# Altium schematic sheet ESD_EARTH.SchDoc
size A3; SheetNumber: 9; SheetTotal: 22
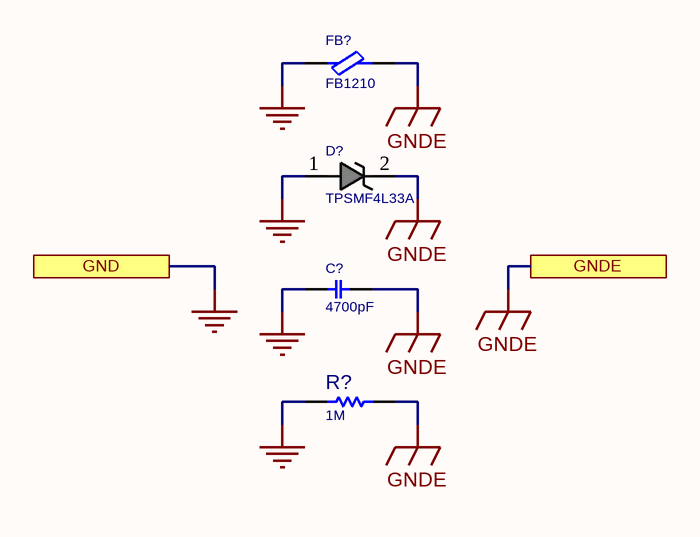
[diagram p0: ESD_EARTH.SchDoc]

## Parts
C?  4700pF  [C1206]
D?  TPSMF4L33A  [D_SOD123W]
FB?  FB1210  [L1210]
R?  1M  [R2512]

## Ports
GND, GNDE

## Nets
GND: C?.1 D?.1 FB?.1 R?.2 ; port GND
GNDE: C?.2 D?.2 FB?.2 R?.1 ; port GNDE

## Library data of the parts
C? = CAP_SMD_MLCC_68n1kv: CAP, MLCC; MANF_P#: NV1206B472K202CEGN; MANF: KEMET; PARAM: X7R, 10%, -55~125oC; PARAM2: 2000V; PRICE: $0.03; VALUE: 4700pF
D? = TVS_TPSMF4L33A: TVS, ESD PROTECT; MANF: Littelfuse; PARAM2: 33.7VRWM, 37VBR; PARAM: -55~150°C; MANF_P#: TPSMF4L33A; PRICE: 0.5$; VALUE: TPSMF4L33A
FB? = FBEAD_SMD_FBMH3225HM202: FERRITE_Bead, 1210, 1.2A, 130mOhm, 2000@100MHz; MANF: Taiyo Yuden; MANF_P#: FBMH3225HM202NT; PARAM: 2000@100MHz; PARAM2: 1.2A; PRICE: 10=1.8$; VALUE: FB1210
R? = RES_SMD: RESISTOR, SMD; PARAM: 1W; DESC: DESCRIPTION; MANF_P#: FRC2512J105 TS; MANF: -; ASSEMBLY: ASSEMBLY; PRICE: $0.02; DIST#: -; PARAM2: -; VALUE: 1M